# Altium schematic sheet LCD to HDMI.SchDoc: HDMI converter
size A3; Author: Vi Tín; SheetNumber: 14; SheetTotal: 16
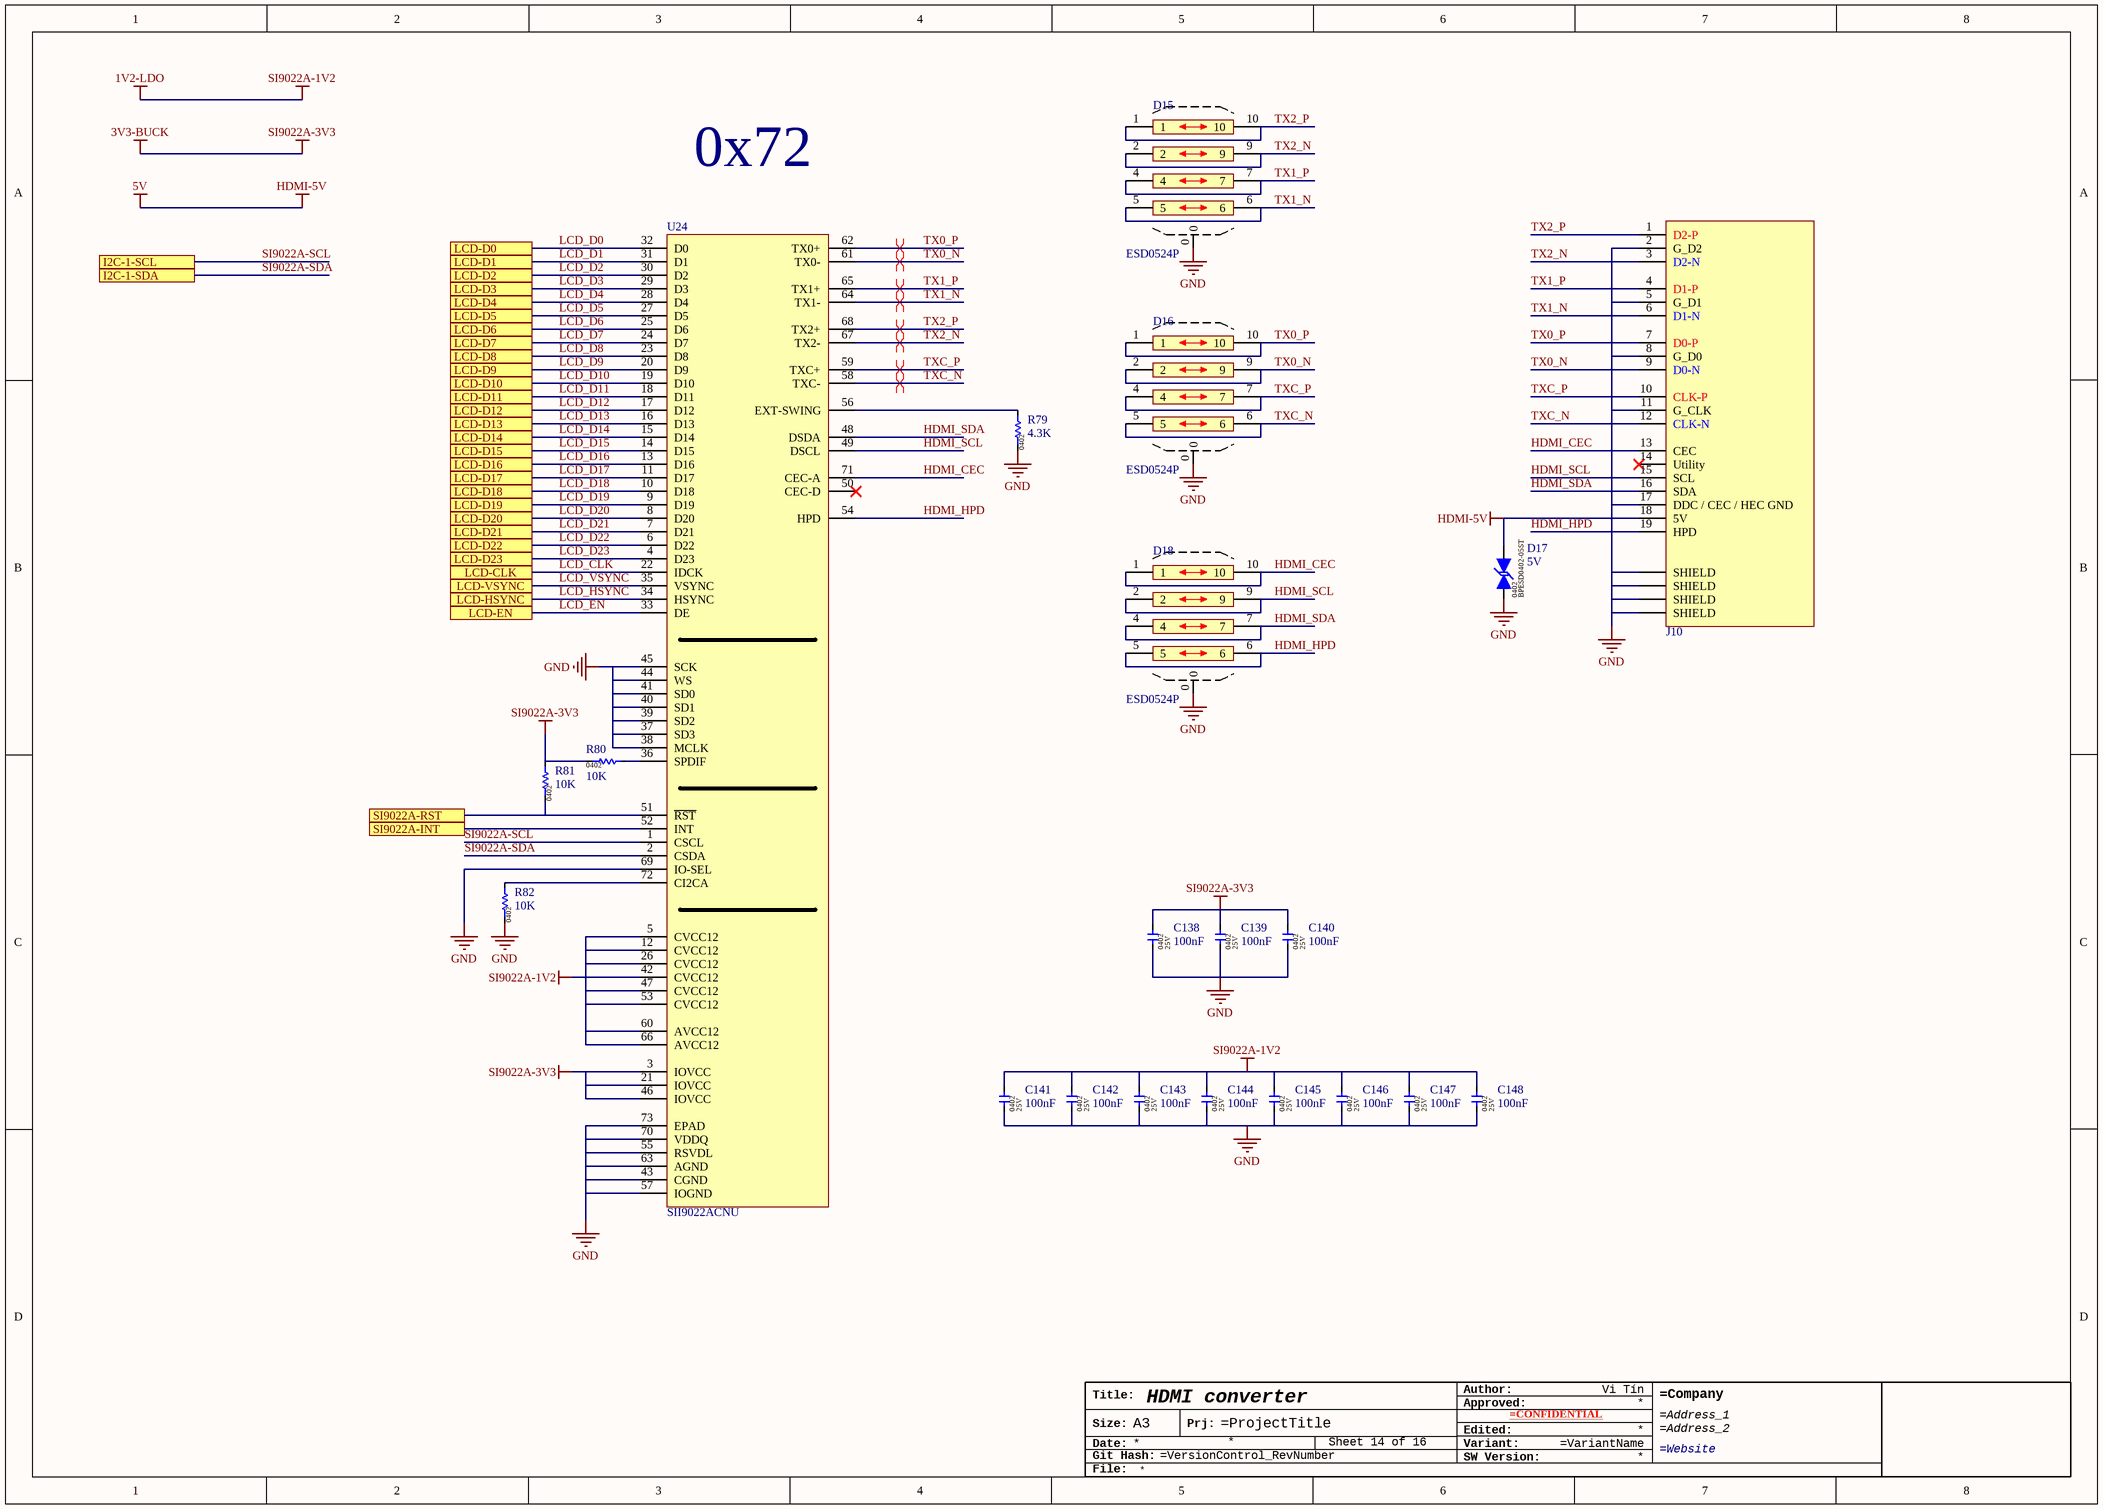
[diagram p0: LCD to HDMI.SchDoc]

## Parts
*?  TitleBlock_Generic  (value not drawn)  (graphical)
C138  100nF  [CAP-0402]
C139  100nF  [CAP-0402]
C140  100nF  [CAP-0402]
C141  100nF  [CAP-0402]
C142  100nF  [CAP-0402]
C143  100nF  [CAP-0402]
C144  100nF  [CAP-0402]
C145  100nF  [CAP-0402]
C146  100nF  [CAP-0402]
C147  100nF  [CAP-0402]
C148  100nF  [CAP-0402]
D15  ESD0524P  [DFN2510]
D16  ESD0524P  [DFN2510]
D17  5V  [Diode-0402]
D18  ESD0524P  [DFN2510]
J10  HDMI-001  [HDMI]  (value not drawn)
R79  4.3K  [RES-0402]
R80  10K  [RES-0402]
R81  10K  [RES-0402]
R82  10K  [RES-0402]
U24  SII9022ACNU  [QFN72_PAD]

## Ports
I2C-1-SCL, I2C-1-SDA, LCD-CLK, LCD-D0, LCD-D1, LCD-D2, LCD-D3, LCD-D4, LCD-D5, LCD-D6, LCD-D7, LCD-D8, LCD-D9, LCD-D10, LCD-D11, LCD-D12, LCD-D13, LCD-D14, LCD-D15, LCD-D16, LCD-D17, LCD-D18, LCD-D19, LCD-D20, LCD-D21, LCD-D22, LCD-D23, LCD-EN, LCD-HSYNC, LCD-VSYNC, SI9022A-INT, SI9022A-RST

## Nets
1V2-LDO: C141.2 C142.2 C143.2 C144.2 C145.2 C146.2 C147.2 C148.2 U24.5(CVCC12) U24.12(CVCC12) U24.26(CVCC12) U24.42(CVCC12) U24.47(CVCC12) U24.53(CVCC12) U24.60(AVCC12) U24.66(AVCC12)  [also labelled SI9022A-1V2]
3V3-BUCK: C138.2 C139.2 C140.2 R80.1 R81.2 U24.3(IOVCC) U24.21(IOVCC) U24.46(IOVCC)  [also labelled SI9022A-3V3]
5V: D17.2 J10.18(5V)  [also labelled HDMI-5V]
GND: C138.1 C139.1 C140.1 C141.1 C142.1 C143.1 C144.1 C145.1 C146.1 C147.1 C148.1 D15.0 D16.0 D17.1 D18.0 J10.0(SHIELD) J10.2(G_D2) J10.5(G_D1) J10.8(G_D0) J10.11(G_CLK) J10.17(DDC_/_CEC_/_HEC_GND) R79.1 R82.1 U24.37(SD3) U24.38(MCLK) U24.39(SD2) U24.40(SD1) U24.41(SD0) U24.43(CGND) U24.44(WS) U24.45(SCK) U24.55(RSVDL) U24.57(IOGND) U24.63(AGND) U24.69(IO-SEL) U24.70(VDDQ) U24.73(EPAD)
HDMI_CEC: D18.1 D18.10 J10.13(CEC) U24.71(CEC-A)
HDMI_HPD: D18.5 D18.6 J10.19(HPD) U24.54(HPD)
HDMI_SCL: D18.2 D18.9 J10.15(SCL) U24.49(DSCL)
HDMI_SDA: D18.4 D18.7 J10.16(SDA) U24.48(DSDA)
LCD_CLK: U24.22(IDCK) ; port LCD-CLK
LCD_D0: U24.32(D0) ; port LCD-D0
LCD_D1: U24.31(D1) ; port LCD-D1
LCD_D2: U24.30(D2) ; port LCD-D2
LCD_D3: U24.29(D3) ; port LCD-D3
LCD_D4: U24.28(D4) ; port LCD-D4
LCD_D5: U24.27(D5) ; port LCD-D5
LCD_D6: U24.25(D6) ; port LCD-D6
LCD_D7: U24.24(D7) ; port LCD-D7
LCD_D8: U24.23(D8) ; port LCD-D8
LCD_D9: U24.20(D9) ; port LCD-D9
LCD_D10: U24.19(D10) ; port LCD-D10
LCD_D11: U24.18(D11) ; port LCD-D11
LCD_D12: U24.17(D12) ; port LCD-D12
LCD_D13: U24.16(D13) ; port LCD-D13
LCD_D14: U24.15(D14) ; port LCD-D14
LCD_D15: U24.14(D15) ; port LCD-D15
LCD_D16: U24.13(D16) ; port LCD-D16
LCD_D17: U24.11(D17) ; port LCD-D17
LCD_D18: U24.10(D18) ; port LCD-D18
LCD_D19: U24.9(D19) ; port LCD-D19
LCD_D20: U24.8(D20) ; port LCD-D20
LCD_D21: U24.7(D21) ; port LCD-D21
LCD_D22: U24.6(D22) ; port LCD-D22
LCD_D23: U24.4(D23) ; port LCD-D23
LCD_EN: U24.33(DE) ; port LCD-EN
LCD_HSYNC: U24.34(HSYNC) ; port LCD-HSYNC
LCD_VSYNC: U24.35(VSYNC) ; port LCD-VSYNC
SI9022A-INT: U24.52(INT) ; port SI9022A-INT
SI9022A-RST: R81.1 U24.51(~{RST}) ; port SI9022A-RST
SI9022A-SCL: U24.1(CSCL) ; port I2C-1-SCL
SI9022A-SDA: U24.2(CSDA) ; port I2C-1-SDA
TX0_N: D16.2 D16.9 J10.9(D0-N) U24.61(TX0-)
TX0_P: D16.1 D16.10 J10.7(D0-P) U24.62(TX0+)
TX1_N: D15.5 D15.6 J10.6(D1-N) U24.64(TX1-)
TX1_P: D15.4 D15.7 J10.4(D1-P) U24.65(TX1+)
TX2_N: D15.2 D15.9 J10.3(D2-N) U24.67(TX2-)
TX2_P: D15.1 D15.10 J10.1(D2-P) U24.68(TX2+)
TXC_N: D16.5 D16.6 J10.12(CLK-N) U24.58(TXC-)
TXC_P: D16.4 D16.7 J10.10(CLK-P) U24.59(TXC+)
NetR79_2: R79.2 U24.56(EXT-SWING)
NetR80_2: R80.2 U24.36(SPDIF)
NetR82_2: R82.2 U24.72(CI2CA)

Not connected (* = marked no-connect by the designer): J10 14(Utility)*; U24 50(CEC-D)*

## Layout directives
differential pair; differential pair class DIFF100_HDMI: TX0_N, TX0_P, TX1_N, TX1_P, TX2_N, TX2_P, TXC_N, TXC_P

## Notes on the sheet
- 0x72
- (in symbol TitleBlock_Generic) Author:; Title:; Approved:; Size:; A3; Prj:; Edited:; Date:; Variant:; SW Version:; Git Hash:; File:

## Library data of the parts
C138-C148 = 0402X104K250CT: 100nF ±10% 25V X5R 0402 Multilayer Ceramic Capacitors MLCC - SMD/SMT RoHS; Manufacture: WALSIN; Package / Case: 0402; Component type: Capacitor; Manufacture part: 0402X104K250CT; Capacitor value: 100nF; Voltage: 25V; Package: 0402
D15 D16 D18 = ESD0524P: DFN2510 ESD Protection Devices ROHS; Manufacture: MDD（Microdiode Electronics）; Type: TVS/ESD Bi diode; Diode value: 5V; Manufacture part: ESD0524P; Package: DFN2510; Datasheet: https://datasheet.lcsc.com/lcsc/2009281808_MDD-Microdiode-Electronics--ESD0524P_C840786.pdf
D17 = BPESD0402-05ST: Bidirectional 40V 5V (Max) 0402 ESD Protection Devices ROHS; Manufacture: BORN; Manufacture part: BPESD0402-05ST; Type: TVS/ESD Bi diode; Diode value: 5V; Package: 0402; Datasheet: https://datasheet.lcsc.com/lcsc/1811031631_BORN-BPESD0402-05ST_C316059.pdf
J10 = HDMI-001: HDMI connector 19 Female Horizontal SMD; Manufacture: BOOMELE(Boom Precision Elec); Manufacture part: HDMI-001; Type: HDMI; Datasheet: https://datasheet.lcsc.com/lcsc/1811111311_BOOMELE-Boom-Precision-Elec-C138388_C138388.pdf
R79 = WR04X4301FTL: 4.3kΩ ±1% 1/16W ±100ppm/℃ 0402 Chip Resistor - Surface Mount RoHS; Manufacture: WALSIN; Package / Case: 0201; Component type: Resistor; Manufacture part: WR04X4301FTL; Resistor value: 4.3K; Package: 0402
R80-R82 = WR04X1002FTL: 10kΩ ±1% 1/16W ±100ppm/℃ 0402 Chip Resistor - Surface Mount RoHS; Manufacture: WALSIN; Package / Case: 0201; Component type: Resistor; Manufacture part: WR04X1002FTL; Resistor value: 10K; Package: 0402
U24 = SII9022ACNU: HDMI transmitter (RGB -> HDMI); Manufacture: Lattice; Manufacture part: SII9022ACNU; Package: QFN-72 (10x10); Datasheet: https://datasheet.lcsc.com/lcsc/1912111437_Lattice-SII9022ACNU_C369565.pdf
*? = TitleBlock_Generic: Manufacture part: TitleBlock_Generic; Manufacture: N/A; Type: Graphic